# Altium schematic sheet USBserial.SchDoc
size A4
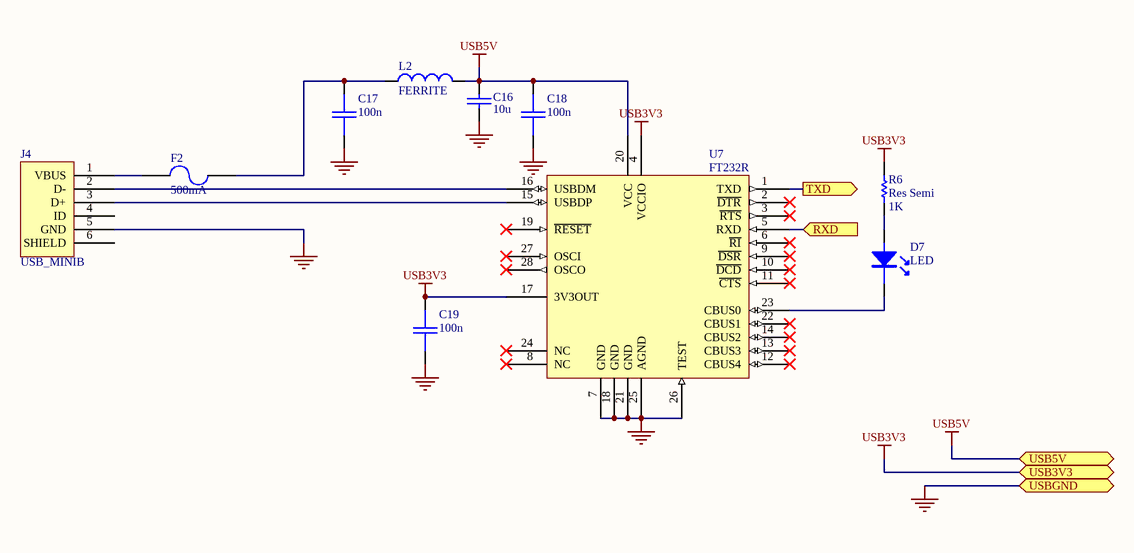
[diagram p0: USBserial.SchDoc]

## Parts
C16  10u  [0805]
C17  100n  [0603]
C18  100n  [0603]
C19  100n  [0603]
D7  LED  [3mmLED]
F2  500mA  [LITTELFUSE-154]
J4  USB_MINIB  [USB_MINIB]
L2  FERRITE  [0805]
R6  Res Semi  value 1K  [1608[0603]]
U7  FT232R  [SSOP28]

## Ports
RXD (in), TXD (out), USB3V3, USB5V, USBGND

## Nets
USB3V3: C19.1 R6.2 U7.4(VCCIO) U7.17(3V3OUT) ; port USB3V3
USB5V: C16.2 C18.1 L2.2 U7.20(VCC) ; port USB5V
USBGND: C16.1 C17.2 C18.2 C19.2 J4.5(GND) U7.7(GND) U7.18(GND) U7.21(GND) U7.25(AGND) U7.26(TEST) ; port USBGND
RXD: U7.5(RXD) ; port RXD
TXD: U7.1(TXD) ; port TXD
NetC17_1: C17.1 F2.2 L2.1
NetD7_A: D7.A R6.1
NetD7_K: D7.K U7.23(CBUS0)
NetF2_1: F2.1 J4.1(VBUS)
NetJ4_2: J4.2(D-) U7.16(USBDM)
NetJ4_3: J4.3(D+) U7.15(USBDP)

Not connected (* = marked no-connect by the designer): J4 4(ID) 6(SHIELD); U7 2(~{DTR})* 3(~{RTS})* 6(~{RI})* 8(NC)* 9(~{DSR})* 10(~{DCD})* 11(~{CTS})* 12(CBUS4)* 13(CBUS3)* 14(CBUS2)* 19(~{RESET})* 22(CBUS1)* 24(NC)* 27(OSCI)* 28(OSCO)*

## Library data of the parts
C16-C19 = CAP: Capacitor
  C16: Element14: 1458902RL; Element14 Price: 0.69
  C17-C19: Element14: 9406140; Element14 Price: 0.13
F2 = FUSE2: Fuse; Element14 Price: 4.60 (min 10); Element14 (low stock): 9943625(holder+fuse); Digikey: F1301CT-ND(holder+fuse); Digikey Price: 3.96
J4 = USB_miniB_SMT: USB Mini B Connector; Element14: 9786473; Element14 Price: $3.08
L2 = INDUCTOR: Manufacturer: Generic Components; Revision: July-2002: Re-released for DXP Platform.; Element14: 1308773; Element14 Price: 0.72
R6 = Res Semi: Semiconductor Resistor; Element14: Stock
U7 = FT232R: USB UART IC; Element14: 1146032; Cost: 7.94
D7 = LED: Element14: 9739190; Element14 Price: 1.37